# Altium schematic sheet 09_USB_Bridge.SchDoc: USB Bridge
size A; Revision: A; SheetNumber: 9; SheetTotal: 10; ECE315_Project_Name: ECE453 Processor Mezzanine
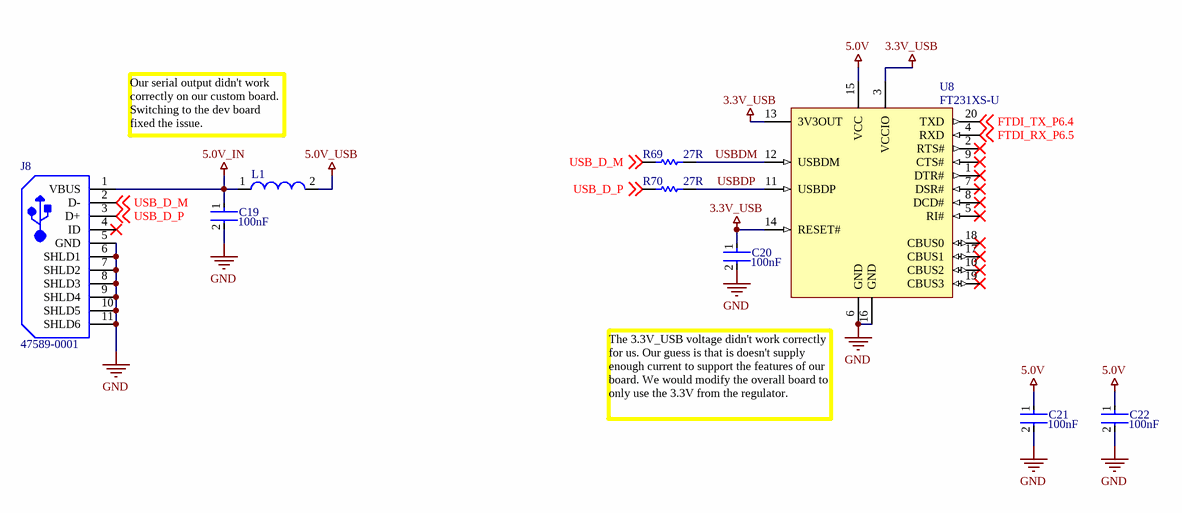
[diagram p0: 09_USB_Bridge.SchDoc]

## Parts
C19  value 100nF  [FP-C0805C-DN-MFG]  (hidden comment: C0805C104K5RACTU)
C20  value 100nF  [FP-C0805C-DN-MFG]  (hidden comment: C0805C104K5RACTU)
C21  value 100nF  [FP-C0805C-DN-MFG]  (hidden comment: C0805C104K5RACTU)
C22  value 100nF  [FP-C0805C-DN-MFG]  (hidden comment: C0805C104K5RACTU)
J8  47589-0001  [MOLX-47589-0001_V]
L1  742792093  [SMD-0805]  (value not drawn)
R69  value 27R  [RESC2013X70X40ML20T20]  (hidden comment: ERJ6ENF27R0V)
R70  value 27R  [RESC2013X70X40ML20T20]  (hidden comment: ERJ6ENF27R0V)
U8  FT231XS-U  [SSOP-20_L]

## Nets
3.3V_USB: C20.1 U8.3(VCCIO) U8.13(3V3OUT) U8.14(RESET#)
5.0V: C21.1 C22.1 U8.15(VCC)
5.0V_IN: C19.1 J8.1(VBUS) L1.1
5.0V_USB: L1.2
GND: C19.2 C20.2 C21.2 C22.2 J8.5(GND) J8.6(SHLD1) J8.7(SHLD2) J8.8(SHLD3) J8.9(SHLD4) J8.10(SHLD5) J8.11(SHLD6) U8.6(GND) U8.16(GND)
FTDI_RX_P6.5: U8.4(RXD) ; off-sheet FTDI_RX_P6.5
FTDI_TX_P6.4: U8.20(TXD) ; off-sheet FTDI_TX_P6.4
USB_D_M: J8.2(D-) R69.1 ; off-sheet USB_D_M
USB_D_P: J8.3(D+) R70.1 ; off-sheet USB_D_P
USBDM: R69.2 U8.12(USBDM)
USBDP: R70.2 U8.11(USBDP)

Not connected (* = marked no-connect by the designer): J8 4(ID)*; U8 1(DTR#)* 2(RTS#)* 5(RI#)* 7(DSR#)* 8(DCD#)* 9(CTS#)* 10(CBUS2)* 17(CBUS1)* 18(CBUS0)* 19(CBUS3)*

## Notes on the sheet
- Our serial output didn't work correctly on our custom board. Switching to the dev board fixed the issue.
- (near U8) The 3.3V_USB voltage didn't work correctly for us. Our guess is that is doesn't supply enough current to support the features of our board. We would modify the overall board to only use the 3.3V from the regulator.
- Title:
- Size:
- A
- Project
- Rev:
- Sheet:
- of
- College of Engineering
- 1415 Engineering Drive
- Madison, WI 53706

## Library data of the parts
C19-C22 = CMP-2007-00279-2: CAP CER 0.1UF 50V X7R 0805; Manufacturer: KEMET; Tolerance: 10%; Voltage: 500V; ComponentLink2Description: Datasheet; ComponentLink2URL: https://content.kemet.com/datasheets/KEM_C1003_C0G_SMD.pdf; Supplier: Newark; Supplier Part Number: 19C6015; Manufacturer Part Number: C0805C104K5RACTU; RoHS: Yes; Category: Ceramic Capacitors; Stock: 3382390; Pricing: 1=0.024, 25=0.024, 50=0.024, 100=0.024, 250=0.024, 500=0.024, 1000=0.024 (USD); Mounting Technology: Surface Mount,PCB; Case/Package: 0805; Pins: 2; Case Code (Imperial): 0805; Case Code (Metric): 2012; Min Operating Temperature: -55°C; Max Operating Temperature: 125°C; Package Quantity: 4000; Voltage Rating: 50V; Packaging: Tape and Reel; Voltage Rating (DC): 50V; Dielectric: X7R; Termination: SMD/SMT; Series: SMD Comm X7R; Construction: Flat; Length: 2mm; Width: 1.2mm; Height: 0.9mm; Lead Pitch: 0.75mm; Depth: 1.25mm; Radiation Hardening: No; RoHS Compliant: Yes; Reach SVHC Compliant: No; ComponentLink1URL: https://datasheet.ciiva.com/32431/slceramic-chip-condensers-e-32431755.pdf?src-supplier=Distrelec; ComponentLink1Description: https://datasheet.ciiva.com/32431/slceramic-chip-condensers-e-32431755.pdf?src-supplier=Distrelec; ComponentLink3URL: https://datasheet.ciiva.com/28682/1851736-28682232.pdf?src-supplier=Element14; ComponentLink3Description: https://datasheet.ciiva.com/28682/1851736-28682232.pdf?src-supplier=Element14
J8 = CMP-2000-05610-1: Right Angle Female Type AB Micro USB Connector, 30 V, 1.8 A, -30 to 85 degC, RoHS, Tape and Reel; Manufacturer: Molex; Voltage Rating: 30V; Contact Resistance: 40mR; Current Rating: 1.8A; Max Voltage Rating (AC): 100V; Connector Type: USB,Receptacle; Number of Ports: 1; Number of Contacts: 5; USB Standard: USB 2.0; Pitch: 0.65mm; Supplier: Newark; Supplier Part Number: 40P3749; Manufacturer Part Number: 47589-0001; RoHS: Yes; Category: USB Connectors; Stock: 10404; Pricing: 1=0.536, 25=0.536, 100=0.492, 250=0.492, 500=0.492, 1000=0.492 (USD); Mounting Technology: Surface Mount,PCB; Contact Plating: Gold; Contact Material: Copper Alloy,Copper; Color: Black; Housing Material: Polymer; Min Operating Temperature: -20°C; Max Operating Temperature: 85°C; Packaging: Tape and Reel; Termination: Solder; Series: 47589; Voltage Rating (AC): 30V; Gender: Female; Orientation: Right Angle; Length: 8.65mm; Radiation Hardening: No; RoHS Compliant: Yes; Reach SVHC Compliant: Unknown; ComponentLink1URL: https://datasheet.ciiva.com/1098/1597783-1098478.pdf?src-supplier=Element14; ComponentLink1Description: https://datasheet.ciiva.com/1098/1597783-1098478.pdf?src-supplier=Element14; ComponentLink2URL: https://datasheet.ciiva.com/11731/0900766b80dfe0a8-11731295.pdf?src-supplier=Rs; ComponentLink2Description: https://datasheet.ciiva.com/11731/0900766b80dfe0a8-11731295.pdf?src-supplier=Rs
L1 = CMP-0220-00169-1: SMD EMI Suppression Ferrite Bead WE-CBF, Z = 2200 Ohm; Manufacturer: Wurth Electronics; Current Rating: 200mA; Tolerance: 25%; Number of Lines: 1; DC Resistance (DCR): 600mR; Test Frequency: 100MHz; Value: 3.9nH; Shielding: Unshielded; DatasheetVersion: Dec-2005; ComponentLink2URL: http://www.we-online.de/katalog/media/pdf/742792093.pdf; PackageDescription: Chip Inductor, 2-Leads, Body 2.0 x 1.2 mm; Impedance: 2200 Ohm; ComponentLink2Description: Datasheet; ComponentLink1Description: Manufacturer Link; PackageReference: SMD-0805; ComponentLink1URL: http://www.we-online.com; PackageVersion: 2005; Supplier: Newark; Supplier Part Number: 24AC5609; Manufacturer Part Number: 742792093; RoHS: Yes; Category: Ferrite Beads and Chips; Stock: 32000; Pricing: 1=0.145, 4000=0.145 (USD); Mounting Technology: Surface Mount; Case/Package: SMD/SMT; Case Code (Metric): 2012; Case Code (Imperial): 0805; Core Material: Ferrite; Weight: 0.000388oz; Min Operating Temperature: -55°C; Max Operating Temperature: 125°C; Package Quantity: 1; Packaging: Tape and Reel; Max Current Rating: 200mA; Max DC Current: 200mA; Termination: SMD/SMT; Series: WE-CBF; Length: 2mm; Width: 1.2mm; Height: 0.9mm; Depth: 1.2mm; RoHS Compliant: Yes; Reach SVHC Compliant: Unknown; Lead Free: Lead Free; ComponentLink3URL: https://datasheet.ciiva.com/1475/742792093-1475025.pdf?src-supplier=Farnell; ComponentLink3Description: https://datasheet.ciiva.com/1475/742792093-1475025.pdf?src-supplier=Farnell; ComponentLink4URL: https://datasheet.ciiva.com/1013/742792093-1013376.pdf?src-supplier=Digi-Key; ComponentLink4Description: https://datasheet.ciiva.com/1013/742792093-1013376.pdf?src-supplier=Digi-Key; ComponentLink5URL: https://datasheet.ciiva.com/4940/742792093-88569-4940476.pdf?src-supplier=Mouser; ComponentLink5Description: https://datasheet.ciiva.com/4940/742792093-88569-4940476.pdf?src-supplier=Mouser; ComponentLink6URL: https://datasheet.ciiva.com/11799/0900766b80bbd134-11799557.pdf?src-supplier=Rs; ComponentLink6Description: https://datasheet.ciiva.com/11799/0900766b80bbd134-11799557.pdf?src-supplier=Rs; ComponentLink7URL: https://datasheet.ciiva.com/14122/742792093-eng-tds-14122810.pdf?src-supplier=Distrelec; ComponentLink7Description: https://datasheet.ciiva.com/14122/742792093-eng-tds-14122810.pdf?src-supplier=Distrelec
R69 R70 = CMP-2001-00529-1: Manufacturer: Vishay; Manufacturer Part Number: CRCW080527R0FKEAHP; Tolerance: 1%; Max Power Dissipation: 500mW; Temperature Coefficient: 100ppm/°C; Power Rating: 330mW; Voltage Rating (DC): 150V; Supplier: Newark; Supplier Part Number: 95AC8908; RoHS: Yes; Category: Chip SMD Resistors; Stock: 20000; Pricing: 1=0.031, 5000=0.031 (USD); Case/Package: 0805; Case Code (Metric): 2012; Case Code (Imperial): 0805; Contact Plating: Tin; Min Operating Temperature: -55°C; Max Operating Temperature: 155°C; Series: CRCW-HP; Packaging: Cut Tape; Number of Terminations: 2; Package Quantity: 5000; Features: Automotive AEC-Q200; Voltage Rating: 150V; Termination: SMD/SMT; Resistor Type: Thick Film; Resistance Tolerance: 1%; Technology: THICK FILM; Length: 0.079inch; Width: 0.049inch; Height: 0.024inch; Depth: 1.25mm; Ratings: AEC-Q200; Radiation Hardening: No; RoHS Compliant: Yes; Lead Free: Lead Free; Reach SVHC Compliant: Unknown; ComponentLink1URL: https://datasheet.ciiva.com/7672/1885357-7672983.pdf?src-supplier=Element14; ComponentLink1Description: https://datasheet.ciiva.com/7672/1885357-7672983.pdf?src-supplier=Element14; ComponentLink2URL: https://datasheet.ciiva.com/2581/crcwhpe3-2581385.pdf?src-supplier=Digi-Key; ComponentLink2Description: https://datasheet.ciiva.com/2581/crcwhpe3-2581385.pdf?src-supplier=Digi-Key; ComponentLink3URL: https://datasheet.ciiva.com/7672/1885357-7672984.pdf?src-supplier=Element14; ComponentLink3Description: https://datasheet.ciiva.com/7672/1885357-7672984.pdf?src-supplier=Element14
U8 = CMP-0248-00015-2: USB to Full-Handshake UART Interface Chip, UHCI/OHCI/EHCI Compatible, USB 2.0 Compatible, -40 to +85 degC, 20-Pin SSOP, Pb-Free, Tube; Manufacturer: FTDI; Manufacturer Part Number: FT231XS-R; Interface: UART,USB; Number of Channels: 1; Max Supply Voltage: 5.5V; Min Supply Voltage: 2.97V; Operating Supply Voltage: 5V; Data Rate: 12Mbps; Operating Supply Current: 8mA; Supplier: Newark; Supplier Part Number: 83T7089; RoHS: Yes; Category: Interface ICs; Stock: 31663; Pricing: 1=3.09, 25=2.65, 100=2.58, 250=2.33 (USD); Mounting Technology: Surface Mount; Case/Package: SSOP; Pins: 20; Weight: 0.016oz; Min Operating Temperature: -40°C; Max Operating Temperature: 85°C; Packaging: Tape and Reel; Series: USBmadeEZ-UART, FT-X, X-Chip; Package Quantity: 1; Length: 8.74mm; Width: 0.157inch; Height: 0.059inch; Radiation Hardening: No; RoHS Compliant: Yes; ComponentLink1URL: https://datasheet.ciiva.com/30478/0900766b811020d3-30478147.pdf?src-supplier=Rs; ComponentLink1Description: https://datasheet.ciiva.com/30478/0900766b811020d3-30478147.pdf?src-supplier=Rs; ComponentLink2URL: https://datasheet.ciiva.com/1787/ft-x-series-1787028.pdf?src-supplier=Digi-Key; ComponentLink2Description: https://datasheet.ciiva.com/1787/ft-x-series-1787028.pdf?src-supplier=Digi-Key; ComponentLink3URL: https://datasheet.ciiva.com/1787/ft-x-series-1787029.pdf?src-supplier=Digi-Key; ComponentLink3Description: https://datasheet.ciiva.com/1787/ft-x-series-1787029.pdf?src-supplier=Digi-Key; ComponentLink4URL: https://datasheet.ciiva.com/1787/ft-x-series-1787030.pdf?src-supplier=Digi-Key; ComponentLink4Description: https://datasheet.ciiva.com/1787/ft-x-series-1787030.pdf?src-supplier=Digi-Key; ComponentLink5URL: https://datasheet.ciiva.com/48909/70403932-48909078.pdf?src-supplier=Allied+Electronics; ComponentLink5Description: https://datasheet.ciiva.com/48909/70403932-48909078.pdf?src-supplier=Allied+Electronics